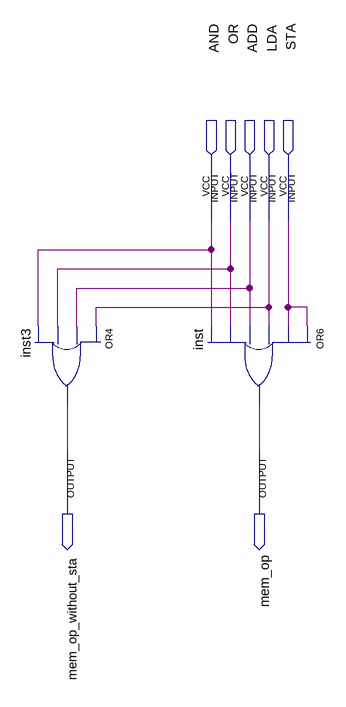
[diagram p0: schematic sheet]
// Quartus schematic uc_mem_op.bdf as structural Verilog: 2 symbols, 7 pins
module uc_mem_op (
  input  AND,
  input  OR,
  input  ADD,
  input  LDA,
  input  STA,
  output mem_op_without_sta,
  output mem_op
);

  or inst3 (mem_op_without_sta, LDA, ADD, OR, AND);
  or inst (mem_op, STA, STA, LDA, ADD, OR, AND);
endmodule
